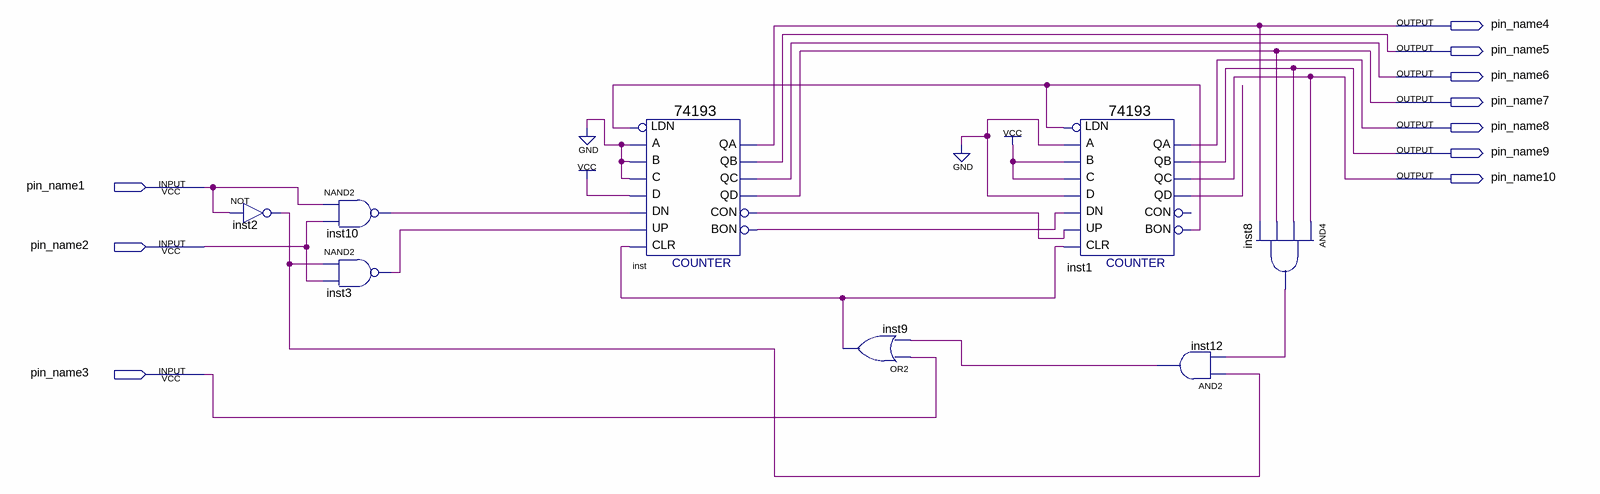
[diagram p0: schematic sheet]
// Quartus schematic rewersyjny.bdf as structural Verilog: 8 symbols, 10 pins
module rewersyjny (
  input  pin_name1,
  input  pin_name2,
  input  pin_name3,
  output pin_name4,
  output pin_name5,
  output pin_name6,
  output pin_name7,
  output pin_name8,
  output pin_name9,
  output pin_name10
);

  wire inst1_bon, inst1_qd, inst2_out, inst3_out, inst8_out, inst9_out, inst10_out, inst12_out, inst_bon,
       inst_con;

  not inst2 (inst2_out, pin_name1);
  nand inst10 (inst10_out, pin_name1, pin_name2);
  nand inst3 (inst3_out, inst2_out, pin_name2);
  \74193  inst (
    .D(1'b1), .C(1'b0), .B(1'b0), .A(1'b0), .CLR(inst9_out), .UP(inst3_out), .DN(inst10_out),
    .LDN(inst1_bon), .QB(pin_name5), .QA(pin_name4), .CON(inst_con), .QD(pin_name7), .QC(pin_name6),
    .BON(inst_bon));
  or inst9 (inst9_out, pin_name3, inst12_out);
  \74193  inst1 (
    .D(1'b0), .C(1'b1), .B(1'b1), .A(1'b0), .CLR(inst9_out), .UP(inst_con), .DN(inst_bon), .LDN(inst1_bon),
    .QB(pin_name9), .QA(pin_name8), .QD(inst1_qd), .QC(pin_name10), .BON(inst1_bon));  // open: CON
  and inst12 (inst12_out, inst2_out, inst8_out);
  and inst8 (inst8_out, pin_name10, pin_name9, pin_name7, pin_name4);
endmodule
